# Altium schematic sheet POW_Block.SchDoc
size A4; SheetNumber: 2; SheetTotal: 15
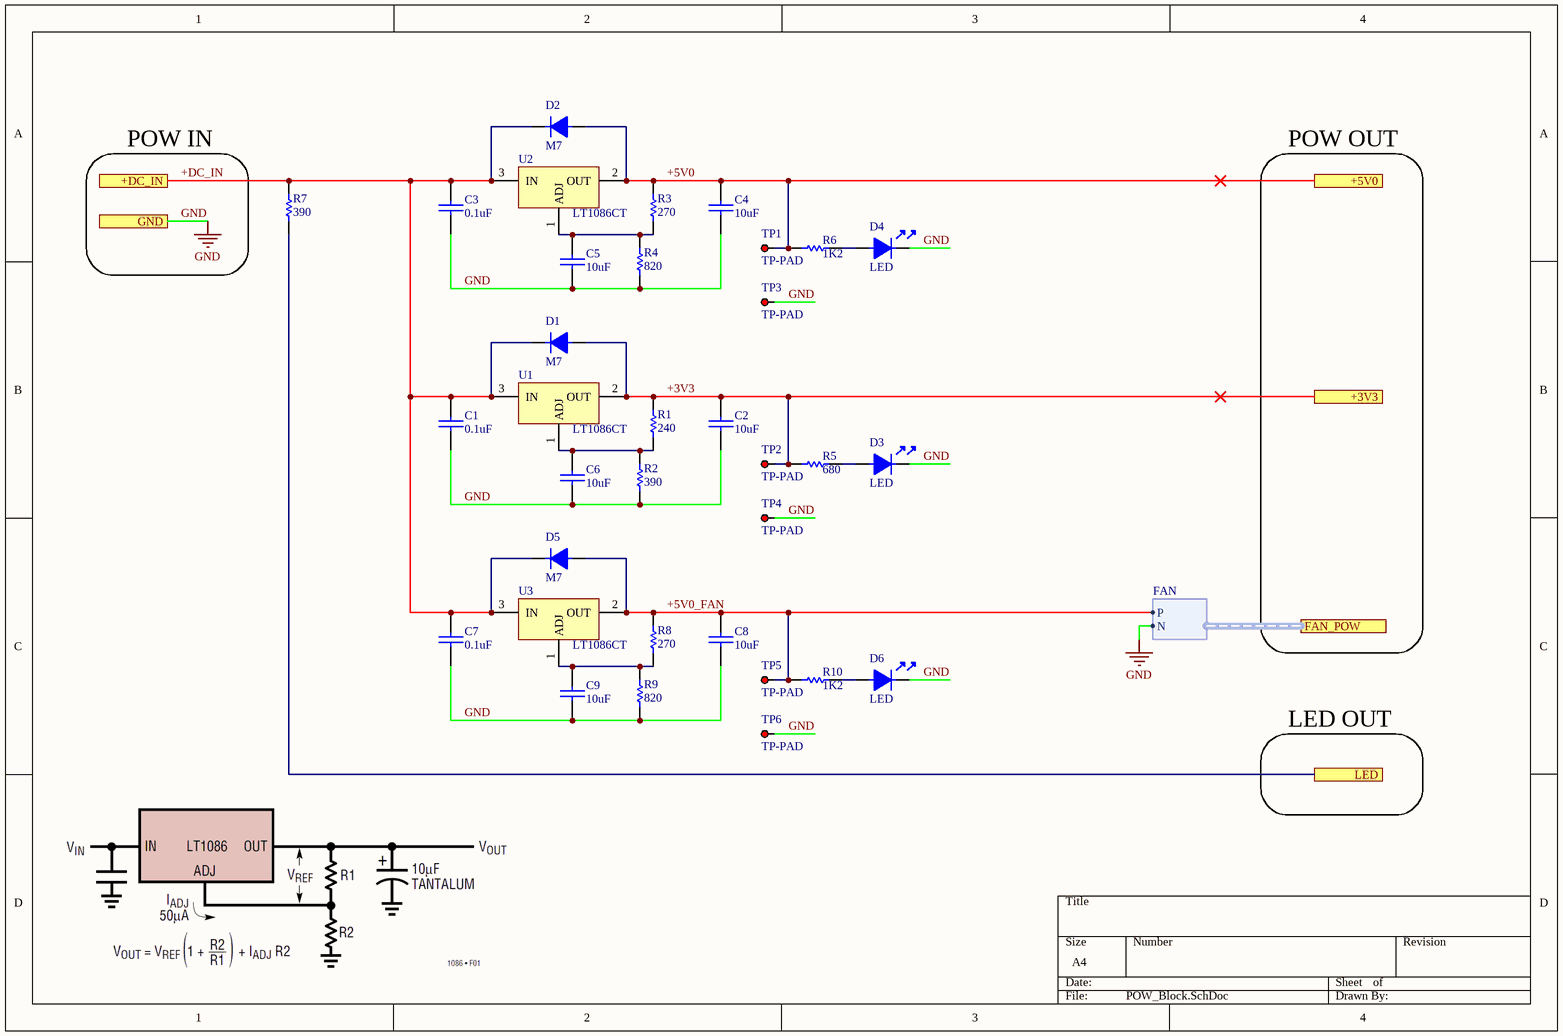
[diagram p0: POW_Block.SchDoc]

## Parts
C1  0.1uF  [0402-CAP-TDK]
C2  10uF  [0603-CAP-TDK]
C3  0.1uF  [0402-CAP-TDK]
C4  10uF  [0603-CAP-TDK]
C5  10uF  [0603-CAP-TDK]
C6  10uF  [0603-CAP-TDK]
C7  0.1uF  [0402-CAP-TDK]
C8  10uF  [0603-CAP-TDK]
C9  10uF  [0603-CAP-TDK]
D1  M7  [DO-214AC-SMA]
D2  M7  [DO-214AC-SMA]
D3  LED  [LED-0805]
D4  LED  [LED-0805]
D5  M7  [DO-214AC-SMA]
D6  LED  [LED-0805]
R1  240  [0805-RES-PANASONIC]
R2  390  [0805-RES-PANASONIC]
R3  270  [0805-RES-PANASONIC]
R4  820  [0805-RES-PANASONIC]
R5  680  [0402-RES-PANASONIC]
R6  1K2  [0402-RES-PANASONIC]
R7  390  [0805-RES-PANASONIC]
R8  270  [0805-RES-PANASONIC]
R9  820  [0805-RES-PANASONIC]
R10  1K2  [0402-RES-PANASONIC]
TP1  TP-PAD  [TPTH - PAD TOP]  (no BOM)
TP2  TP-PAD  [TPTH - PAD TOP]  (no BOM)
TP3  TP-PAD  [TPTH - PAD TOP]  (no BOM)
TP4  TP-PAD  [TPTH - PAD TOP]  (no BOM)
TP5  TP-PAD  [TPTH - PAD TOP]  (no BOM)
TP6  TP-PAD  [TPTH - PAD TOP]  (no BOM)
U1  LT1086CT  [TO-220 - KCS0003B]
U2  LT1086CT  [TO-220 - KCS0003B]
U3  LT1086CT  [TO-220 - KCS0003B]

## Ports
+3V3, +5V0, +DC_IN, FAN_POW (harness FAN), GND, LED

## Harnesses
FAN: P, N

## Nets
GND: C1.1 C2.1 C3.1 C4.1 C5.1 C6.1 C7.1 C8.1 C9.1 D3.2 D4.2 D6.2 R2.1 R4.1 R9.1 TP3.1 TP4.1 TP6.1 ; port GND, port FAN_POW.N
+3V3: C2.2 D1.1 R1.2 R5.1 TP2.1 U1.2(OUT) ; port +3V3
+5V0: C4.2 D2.1 R3.2 R6.1 TP1.1 U2.2(OUT) ; port +5V0
+5V0_FAN: C8.2 D5.1 R8.2 R10.1 TP5.1 U3.2(OUT) ; port FAN_POW.P
+DC_IN: C1.2 C3.2 C7.2 D1.2 D2.2 D5.2 R7.2 U1.3(IN) U2.3(IN) U3.3(IN) ; port +DC_IN
LED: R7.1 ; port LED
NetC5_2: C5.2 R3.1 R4.2 U2.1(ADJ)
NetC6_2: C6.2 R1.1 R2.2 U1.1(ADJ)
NetC9_2: C9.2 R8.1 R9.2 U3.1(ADJ)
NetD3_1: D3.1 R5.2
NetD4_1: D4.1 R6.2
NetD6_1: D6.1 R10.2

## Notes on the sheet
- POW IN
- POW OUT
- LED OUT

## Library data of the parts
C1-C9 = CAP-SMD
  C1 C3 C7: JLCPart: C307331
  C2 C4-C6 C8 C9: JLCPart: C96446
D1 D2 D5 = M7: Diode Rectifier 1A 1kV; JLCPart: C95872
D3 D4 D6 = LED-SMD: JLCPart: C84256
R1-R10 = RES-SMD
  R1: JLCPart: C17572
  R2 R7: JLCPart: C17655
  R3 R8: JLCPart: C17590
  R4 R9: JLCPart: C17837
  R5: JLCPart: C25130
  R6 R10: JLCPart: C25862